# Altium schematic sheet StepperDriver.SchDoc
size A
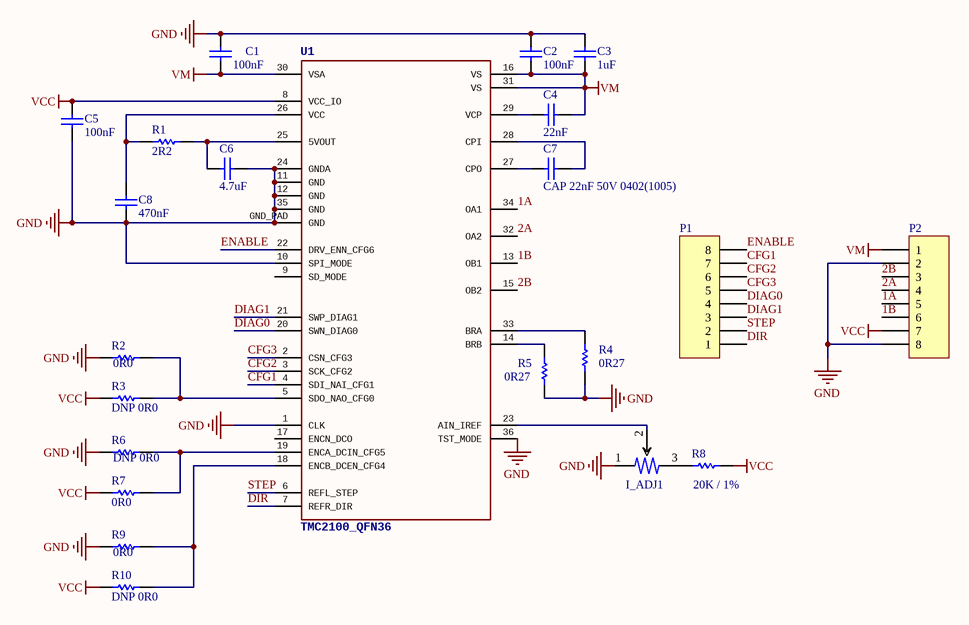
[diagram p0: StepperDriver.SchDoc]

## Parts
C1  100nF  [CAPC0402(1005)60_M]
C2  100nF  [CAPC0402(1005)60_M]
C3  1uF  [CAPC0603(1608)100_L]
C4  22nF  [CAPC0402(1005)60_L]
C5  100nF  [CAPC0402(1005)60_M]
C6  4.7uF  [CAPC0402(1005)60_N]
C7  CAP 22nF 50V 0402(1005)  [CAPC0402(1005)60_L]
C8  470nF  [CAPC0402(1005)60_N]
I_ADJ1  PVZ3A Trimmer  [PVZ3A]  (value not drawn)
P1  Header 8  [HDR1X8]  (value not drawn)
P2  Header 8  [HDR1X8]  (value not drawn)
R1  2R2  [RESC0402(1005)_N]
R2  0R0  [RESC0402(1005)_N]
R3  DNP 0R0  [RESC0402(1005)_N]
R4  0R27  [RESC0805(2012)_N]
R5  0R27  [RESC0805(2012)_N]
R6  DNP 0R0  [RESC0402(1005)_N]
R7  0R0  [RESC0402(1005)_N]
R8  20K / 1%  [RESC0402(1005)_L]
R9  0R0  [RESC0402(1005)_N]
R10  DNP 0R0  [RESC0402(1005)_N]
U1  TMC2100_QFN36  [QFN36]

## Nets
GND: C1.2 C2.2 C3.2 C5.1 C6.1 C8.1 I_ADJ1.1(CCW) P2.2 P2.8 R2.1 R4.1 R5.1 R6.1 R9.1 U1.1(CLK) U1.10(SPI_MODE) U1.11(GND) U1.12(GND) U1.24(GNDA) U1.35(GND) U1.36(TST_MODE) U1.GND_PAD(GND)
VCC: C5.2 P2.7 R3.1 R7.1 R8.2 R10.1 U1.8(VCC_IO)
VM: C1.1 C2.1 C3.1 C4.2 P2.1 U1.16(VS) U1.30(VSA) U1.31(VS)
1A: P2.5 U1.34(OA1)
1B: P2.6 U1.13(OB1)
2A: P2.4 U1.32(OA2)
2B: P2.3 U1.15(OB2)
CFG1: P1.7 U1.4(SDI_NAI_CFG1)
CFG2: P1.6 U1.3(SCK_CFG2)
CFG3: P1.5 U1.2(CSN_CFG3)
DIAG0: P1.4 U1.20(SWN_DIAG0)
DIAG1: P1.3 U1.21(SWP_DIAG1)
DIR: P1.1 U1.7(REFR_DIR)
ENABLE: P1.8 U1.22(DRV_ENN_CFG6)
STEP: P1.2 U1.6(REFL_STEP)
NetC4_1: C4.1 U1.29(VCP)
NetC6_2: C6.2 R1.2 U1.25(5VOUT)
NetC7_1: C7.1 U1.28(CPI)
NetC7_2: C7.2 U1.27(CPO)
NetC8_2: C8.2 R1.1 U1.26(VCC)
NetI_ADJ1_2: I_ADJ1.2(OUT) U1.23(AIN_IREF)
NetI_ADJ1_3: I_ADJ1.3(CW) R8.1
NetR2_2: R2.2 R3.2 U1.5(SDO_NAO_CFG0)
NetR4_2: R4.2 U1.33(BRA)
NetR5_2: R5.2 U1.14(BRB)
NetR6_2: R6.2 R7.2 U1.19(ENCA_DCIN_CFG5)
NetR9_2: R9.2 R10.2 U1.18(ENCB_DCEN_CFG4)

Not connected (* = marked no-connect by the designer): U1 9(SD_MODE) 17(ENCN_DCO)

## Library data of the parts
C1 C2 C5 = CMP-1034-02077-1: CAP 100nF 50V ±10% 0402 (1005 Metric) Thickness 0.6mm SMD; Case-Metric: 1005; Case-EIA: 0402; Tolerance: Â±10%; Value: 100nF; Rated Voltage: 50 V; Technology: SMT; Max Thickness: 0.6 mm
C3 = CMP-1035-02745-1: CAP 1uF 50V ±10% 0603 (1608 Metric) Thickness 1mm SMD; Case-EIA: 0603; Case-Metric: 1608; Tolerance: Â±10%; Technology: SMT; Value: 1uF; Rated Voltage: 50 V; Max Thickness: 1 mm
C4 C7 = CMP-1034-01957-1: CAP 22nF 50V ±5% 0402 (1005 Metric) Thickness 0.6mm SMD; Tolerance: Â±5%; Case-EIA: 0402; Case-Metric: 1005; Technology: SMT; Rated Voltage: 50 V; Value: 22nF; Max Thickness: 0.6 mm
C6 = CMP-1034-02127-1: CAP 2.2uF 10V ±10% 0402 (1005 Metric) Thickness 0.6mm SMD; Case-EIA: 0402; Tolerance: Â±10%; Case-Metric: 1005; Technology: SMT; Rated Voltage: 10 V; Value: 2.2uF; Max Thickness: 0.6 mm
C8 = CMP-1034-02106-1: CAP 470nF 10V ±10% 0402 (1005 Metric) Thickness 0.6mm SMD; Tolerance: Â±10%; Case-EIA: 0402; Case-Metric: 1005; Value: 470nF; Technology: SMT; Rated Voltage: 10 V; Max Thickness: 0.6 mm
P1 P2 = Header 8: Header, 8-Pin; LatestRevisionDate: 17-Jul-2002; LatestRevisionNote: Re-released for DXP Platform.; Publisher: Altium Limited
R1 = CMP-1011-00010-1: 2R2 0.063W 5% 0402 (1005 Metric)  SMD; Case-Metric: 1005; Case-EIA: 0402; Value: 2.20 Ohm; Tolerance: 5 %; Power: 0.063 W; Technology: SMT
R2 R3 R6 R7 R9 R10 = CMP-1011-00001-1: Jumper 0402 (1005 Metric); Tolerance: None; Case-Metric: 1005; Case-EIA: 0402; Value: 0.00 Ohm; Power: None; Technology: SMT
R4 R5 = CMP-1013-00001-1: Jumper 0805 (2012 Metric); Case-EIA: 0805; Value: 0.00 Ohm; Tolerance: None; Case-Metric: 2012; Technology: SMT; Power: None
R8 = CMP-1591-00004-1: 0402 (1005 Metric) Chip Resistor; Case-EIA: 0402; Case-Metric: 1005; PackageReference: RESC0402(1005)